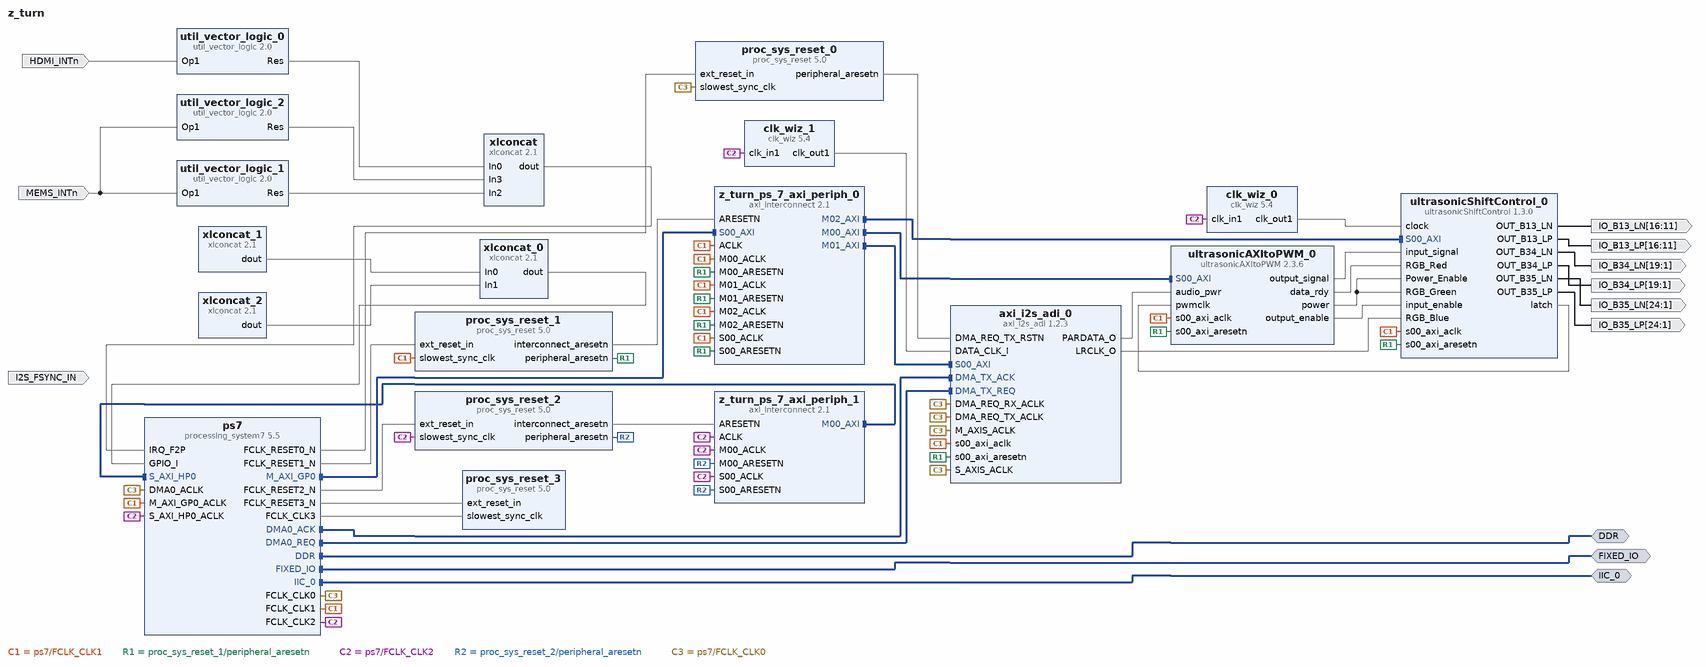
[diagram p0: block diagram of the top level]
# Vivado block design z_turn, xc7z020clg400-1, Vivado 2017.1
create_bd_design z_turn

create_bd_intf_port -mode Master -vlnv xilinx.com:interface:ddrx_rtl:1.0 DDR
create_bd_intf_port -mode Master -vlnv xilinx.com:display_processing_system7:fixedio_rtl:1.0 FIXED_IO
create_bd_intf_port -mode Master -vlnv xilinx.com:interface:iic_rtl:1.0 IIC_0
create_bd_port -dir I I2S_FSYNC_IN
create_bd_port -dir I HDMI_INTn
create_bd_port -dir I MEMS_INTn
create_bd_port -dir O -from 24 -to 1 IO_B35_LP
create_bd_port -dir O -from 24 -to 1 IO_B35_LN
create_bd_port -dir O -from 19 -to 1 IO_B34_LP
create_bd_port -dir O -from 19 -to 1 IO_B34_LN
create_bd_port -dir O -from 16 -to 11 IO_B13_LP
create_bd_port -dir O -from 16 -to 11 IO_B13_LN

create_bd_cell -type ip -vlnv xilinx.com:ip:xlconcat:2.1 xlconcat
set_property -dict {CONFIG.NUM_PORTS 16} [get_bd_cells xlconcat]
create_bd_cell -type ip -vlnv xilinx.com:ip:xlconcat:2.1 xlconcat_0
set_property -dict {CONFIG.IN0_WIDTH 32 CONFIG.IN1_WIDTH 32} [get_bd_cells xlconcat_0]
create_bd_cell -type ip -vlnv xilinx.com:ip:xlconcat:2.1 xlconcat_1
set_property -dict {CONFIG.NUM_PORTS 32} [get_bd_cells xlconcat_1]
create_bd_cell -type ip -vlnv xilinx.com:ip:xlconcat:2.1 xlconcat_2
set_property -dict {CONFIG.NUM_PORTS 29 CONFIG.IN24_WIDTH 4 CONFIG.IN28_WIDTH 1} [get_bd_cells xlconcat_2]
create_bd_cell -type ip -vlnv xilinx.com:ip:clk_wiz:5.4 clk_wiz_0
set_property -dict [list \
  CONFIG.PRIMITIVE PLL \
  CONFIG.CLKOUT1_REQUESTED_OUT_FREQ 166.5 \
  CONFIG.CLKOUT1_DRIVES BUFG \
  CONFIG.CLKOUT2_DRIVES BUFG \
  CONFIG.CLKOUT3_DRIVES BUFG \
  CONFIG.CLKOUT4_DRIVES BUFG \
  CONFIG.CLKOUT5_DRIVES BUFG \
  CONFIG.CLKOUT6_DRIVES BUFG \
  CONFIG.CLKOUT7_DRIVES BUFG \
  CONFIG.USE_LOCKED true \
  CONFIG.USE_RESET false \
  CONFIG.MMCM_DIVCLK_DIVIDE 1 \
  CONFIG.MMCM_CLKFBOUT_MULT_F 10 \
  CONFIG.MMCM_CLKIN1_PERIOD 10.000 \
  CONFIG.MMCM_CLKIN2_PERIOD 10.000 \
  CONFIG.MMCM_COMPENSATION ZHOLD \
  CONFIG.MMCM_CLKOUT0_DIVIDE_F 6 \
  CONFIG.CLKOUT1_JITTER 118.758 \
  CONFIG.CLKOUT1_PHASE_ERROR 98.575 \
] [get_bd_cells clk_wiz_0]
create_bd_cell -type ip -vlnv xilinx.com:ip:proc_sys_reset:5.0 proc_sys_reset_2
create_bd_cell -type ip -vlnv xilinx.com:ip:proc_sys_reset:5.0 proc_sys_reset_3
create_bd_cell -type ip -vlnv xilinx.com:ip:proc_sys_reset:5.0 proc_sys_reset_0
create_bd_cell -type ip -vlnv xilinx.com:ip:processing_system7:5.5 ps7
set_property -dict [list \
  CONFIG.PCW_FCLK_CLK1_BUF TRUE \
  CONFIG.PCW_FCLK_CLK2_BUF TRUE \
  CONFIG.PCW_FCLK_CLK3_BUF TRUE \
  CONFIG.PCW_I2C_PERIPHERAL_FREQMHZ 111.111115 \
  CONFIG.PCW_FPGA0_PERIPHERAL_FREQMHZ 166.667 \
  CONFIG.PCW_FPGA2_PERIPHERAL_FREQMHZ 100 \
  CONFIG.PCW_FPGA3_PERIPHERAL_FREQMHZ 200 \
  CONFIG.PCW_USE_S_AXI_HP0 1 \
  CONFIG.PCW_USE_DMA0 1 \
  CONFIG.PCW_USE_FABRIC_INTERRUPT 1 \
  CONFIG.PCW_EN_CLK1_PORT 1 \
  CONFIG.PCW_EN_CLK2_PORT 1 \
  CONFIG.PCW_EN_CLK3_PORT 1 \
  CONFIG.PCW_EN_RST1_PORT 1 \
  CONFIG.PCW_EN_RST2_PORT 1 \
  CONFIG.PCW_EN_RST3_PORT 1 \
  CONFIG.PCW_IRQ_F2P_INTR 1 \
  CONFIG.PCW_PERIPHERAL_BOARD_PRESET part0 \
  CONFIG.PCW_PRESET_BANK1_VOLTAGE {LVCMOS 1.8V} \
  CONFIG.PCW_UIPARAM_DDR_PARTNO {MT41K256M16 RE-15E} \
  CONFIG.PCW_QSPI_PERIPHERAL_ENABLE 1 \
  CONFIG.PCW_QSPI_QSPI_IO {MIO 1 .. 6} \
  CONFIG.PCW_QSPI_GRP_SINGLE_SS_ENABLE 1 \
  CONFIG.PCW_QSPI_GRP_SINGLE_SS_IO {MIO 1 .. 6} \
  CONFIG.PCW_QSPI_GRP_FBCLK_ENABLE 1 \
  CONFIG.PCW_QSPI_GRP_FBCLK_IO {MIO 8} \
  CONFIG.PCW_ENET0_PERIPHERAL_ENABLE 1 \
  CONFIG.PCW_ENET0_ENET0_IO {MIO 16 .. 27} \
  CONFIG.PCW_ENET0_GRP_MDIO_ENABLE 1 \
  CONFIG.PCW_ENET0_GRP_MDIO_IO {MIO 52 .. 53} \
  CONFIG.PCW_ENET_RESET_ENABLE 0 \
  CONFIG.PCW_SD0_PERIPHERAL_ENABLE 1 \
  CONFIG.PCW_SD0_SD0_IO {MIO 40 .. 45} \
  CONFIG.PCW_SD0_GRP_CD_ENABLE 1 \
  CONFIG.PCW_SD0_GRP_CD_IO {MIO 46} \
  CONFIG.PCW_SD0_GRP_WP_ENABLE 1 \
  CONFIG.PCW_SD0_GRP_WP_IO {MIO 47} \
  CONFIG.PCW_UART1_PERIPHERAL_ENABLE 1 \
  CONFIG.PCW_UART1_UART1_IO {MIO 48 .. 49} \
  CONFIG.PCW_CAN0_PERIPHERAL_ENABLE 1 \
  CONFIG.PCW_CAN0_CAN0_IO {MIO 14 .. 15} \
  CONFIG.PCW_USB0_PERIPHERAL_ENABLE 1 \
  CONFIG.PCW_USB0_USB0_IO {MIO 28 .. 39} \
  CONFIG.PCW_USB_RESET_ENABLE 1 \
  CONFIG.PCW_USB_RESET_SELECT {Share reset pin} \
  CONFIG.PCW_USB0_RESET_ENABLE 1 \
  CONFIG.PCW_USB0_RESET_IO {MIO 51} \
  CONFIG.PCW_I2C0_PERIPHERAL_ENABLE 1 \
  CONFIG.PCW_I2C0_I2C0_IO EMIO \
  CONFIG.PCW_I2C1_PERIPHERAL_ENABLE 1 \
  CONFIG.PCW_I2C1_I2C1_IO {MIO 12 .. 13} \
  CONFIG.PCW_I2C_RESET_ENABLE 0 \
  CONFIG.PCW_GPIO_MIO_GPIO_ENABLE 1 \
  CONFIG.PCW_GPIO_MIO_GPIO_IO MIO \
  CONFIG.PCW_GPIO_EMIO_GPIO_ENABLE 1 \
  CONFIG.PCW_GPIO_EMIO_GPIO_IO 64 \
  CONFIG.PCW_FPGA_FCLK1_ENABLE 1 \
  CONFIG.PCW_FPGA_FCLK2_ENABLE 1 \
  CONFIG.PCW_FPGA_FCLK3_ENABLE 1 \
] [get_bd_cells ps7]
# 223 more settings of ps7 are not shown: defaults, MIO pin electricals, DDR timing, and values the tool derives
create_bd_cell -type ip -vlnv xilinx.com:ip:axi_interconnect:2.1 z_turn_ps_7_axi_periph_0
set_property -dict {CONFIG.NUM_MI 3 CONFIG.S00_HAS_DATA_FIFO 0} [get_bd_cells z_turn_ps_7_axi_periph_0]
create_bd_cell -type ip -vlnv xilinx.com:ip:axi_interconnect:2.1 z_turn_ps_7_axi_periph_1
set_property -dict {CONFIG.NUM_MI 1 CONFIG.S00_HAS_DATA_FIFO 0} [get_bd_cells z_turn_ps_7_axi_periph_1]
create_bd_cell -type ip -vlnv xilinx.com:ip:proc_sys_reset:5.0 proc_sys_reset_1
create_bd_cell -type ip -vlnv xilinx.com:ip:util_vector_logic:2.0 util_vector_logic_0
set_property -dict {CONFIG.C_SIZE 1 CONFIG.C_OPERATION not} [get_bd_cells util_vector_logic_0]
create_bd_cell -type ip -vlnv xilinx.com:ip:util_vector_logic:2.0 util_vector_logic_1
set_property -dict {CONFIG.C_SIZE 1 CONFIG.C_OPERATION not} [get_bd_cells util_vector_logic_1]
create_bd_cell -type ip -vlnv xilinx.com:ip:util_vector_logic:2.0 util_vector_logic_2
set_property -dict {CONFIG.C_SIZE 1 CONFIG.C_OPERATION not} [get_bd_cells util_vector_logic_2]
create_bd_cell -type ip -vlnv xilinx.com:ip:clk_wiz:5.4 clk_wiz_1
set_property -dict [list \
  CONFIG.CLKOUT1_REQUESTED_OUT_FREQ 22.5792 \
  CONFIG.USE_RESET false \
  CONFIG.MMCM_DIVCLK_DIVIDE 9 \
  CONFIG.MMCM_CLKFBOUT_MULT_F 63.250 \
  CONFIG.MMCM_CLKOUT0_DIVIDE_F 31.125 \
  CONFIG.CLKOUT1_JITTER 629.510 \
  CONFIG.CLKOUT1_PHASE_ERROR 767.789 \
] [get_bd_cells clk_wiz_1]
create_bd_cell -type ip -vlnv digilentinc.com:user:axi_i2s_adi:1.2.3 axi_i2s_adi_0
set_property -dict {CONFIG.C_DMA_TYPE 1 CONFIG.C_HAS_RX 0} [get_bd_cells axi_i2s_adi_0]
create_bd_cell -type ip -vlnv user.org:user:ultrasonicShiftControl:1.3.0 ultrasonicShiftControl_0
create_bd_cell -type ip -vlnv user.org:user:ultrasonicAXItoPWM:2.3.6 ultrasonicAXItoPWM_0

# ---- connections ----

connect_bd_intf_net -intf_net ps_7_M_AXI_GP0 [get_bd_intf_pins ps7/M_AXI_GP0] [get_bd_intf_pins z_turn_ps_7_axi_periph_0/S00_AXI]
connect_bd_intf_net -intf_net io2axis_M00_AXI [get_bd_intf_pins z_turn_ps_7_axi_periph_1/M00_AXI] [get_bd_intf_pins ps7/S_AXI_HP0]
connect_bd_intf_net [get_bd_intf_pins z_turn_ps_7_axi_periph_0/M01_AXI] [get_bd_intf_pins axi_i2s_adi_0/S00_AXI]
connect_bd_intf_net [get_bd_intf_pins ps7/DMA0_ACK] [get_bd_intf_pins axi_i2s_adi_0/DMA_TX_ACK]
connect_bd_intf_net [get_bd_intf_pins ps7/DMA0_REQ] [get_bd_intf_pins axi_i2s_adi_0/DMA_TX_REQ]
connect_bd_intf_net [get_bd_intf_pins z_turn_ps_7_axi_periph_0/M02_AXI] [get_bd_intf_pins ultrasonicShiftControl_0/S00_AXI]
connect_bd_intf_net [get_bd_intf_pins z_turn_ps_7_axi_periph_0/M00_AXI] [get_bd_intf_pins ultrasonicAXItoPWM_0/S00_AXI]
connect_bd_intf_net -intf_net ps_7_DDR [get_bd_intf_ports DDR] [get_bd_intf_pins ps7/DDR]
connect_bd_intf_net -intf_net ps_7_FIXED_IO [get_bd_intf_ports FIXED_IO] [get_bd_intf_pins ps7/FIXED_IO]
connect_bd_intf_net [get_bd_intf_ports IIC_0] [get_bd_intf_pins ps7/IIC_0]
connect_bd_net -net xlconcat_0_dout [get_bd_pins xlconcat/dout] [get_bd_pins ps7/IRQ_F2P]
connect_bd_net -net ps_7_FCLK_CLK0 [get_bd_pins ps7/FCLK_CLK1] \
  [get_bd_pins ps7/M_AXI_GP0_ACLK] [get_bd_pins proc_sys_reset_1/slowest_sync_clk] [get_bd_pins axi_i2s_adi_0/s00_axi_aclk] \
  [get_bd_pins ultrasonicShiftControl_0/s00_axi_aclk] [get_bd_pins z_turn_ps_7_axi_periph_0/ACLK] \
  [get_bd_pins z_turn_ps_7_axi_periph_0/S00_ACLK] [get_bd_pins z_turn_ps_7_axi_periph_0/M00_ACLK] \
  [get_bd_pins z_turn_ps_7_axi_periph_0/M01_ACLK] [get_bd_pins z_turn_ps_7_axi_periph_0/M02_ACLK] \
  [get_bd_pins ultrasonicAXItoPWM_0/s00_axi_aclk]
connect_bd_net -net rst_ps_7_166M_peripheral_aresetn [get_bd_pins proc_sys_reset_1/peripheral_aresetn] \
  [get_bd_pins axi_i2s_adi_0/s00_axi_aresetn] [get_bd_pins ultrasonicShiftControl_0/s00_axi_aresetn] \
  [get_bd_pins z_turn_ps_7_axi_periph_0/S00_ARESETN] [get_bd_pins z_turn_ps_7_axi_periph_0/M00_ARESETN] \
  [get_bd_pins z_turn_ps_7_axi_periph_0/M01_ARESETN] [get_bd_pins z_turn_ps_7_axi_periph_0/M02_ARESETN] \
  [get_bd_pins ultrasonicAXItoPWM_0/s00_axi_aresetn]
connect_bd_net -net rst_ps_7_166M_interconnect_aresetn [get_bd_pins proc_sys_reset_1/interconnect_aresetn] \
  [get_bd_pins z_turn_ps_7_axi_periph_0/ARESETN]
connect_bd_net -net ps_7_FCLK_CLK2 [get_bd_pins ps7/FCLK_CLK2] \
  [get_bd_pins clk_wiz_0/clk_in1] [get_bd_pins proc_sys_reset_2/slowest_sync_clk] [get_bd_pins ps7/S_AXI_HP0_ACLK] \
  [get_bd_pins clk_wiz_1/clk_in1] [get_bd_pins z_turn_ps_7_axi_periph_1/ACLK] [get_bd_pins z_turn_ps_7_axi_periph_1/S00_ACLK] \
  [get_bd_pins z_turn_ps_7_axi_periph_1/M00_ACLK]
connect_bd_net -net ps_7_FCLK_RESET1_N [get_bd_pins ps7/FCLK_RESET1_N] [get_bd_pins proc_sys_reset_1/ext_reset_in]
connect_bd_net -net ps_7_FCLK_RESET2_N [get_bd_pins ps7/FCLK_RESET2_N] [get_bd_pins proc_sys_reset_2/ext_reset_in]
connect_bd_net -net proc_sys_reset2_interconnect_aresetn [get_bd_pins proc_sys_reset_2/interconnect_aresetn] \
  [get_bd_pins z_turn_ps_7_axi_periph_1/ARESETN]
connect_bd_net -net proc_sys_reset2_peripheral_aresetn [get_bd_pins proc_sys_reset_2/peripheral_aresetn] \
  [get_bd_pins z_turn_ps_7_axi_periph_1/S00_ARESETN] [get_bd_pins z_turn_ps_7_axi_periph_1/M00_ARESETN]
connect_bd_net -net ps_7_FCLK_RESET0_N [get_bd_pins ps7/FCLK_RESET0_N] [get_bd_pins proc_sys_reset_0/ext_reset_in]
connect_bd_net -net ps_7_FCLK_RESET3_N [get_bd_pins ps7/FCLK_RESET3_N] [get_bd_pins proc_sys_reset_3/ext_reset_in]
connect_bd_net -net ps_7_FCLK_CLK3 [get_bd_pins ps7/FCLK_CLK3] [get_bd_pins proc_sys_reset_3/slowest_sync_clk]
connect_bd_net -net ps_7_FCLK_CLK1 [get_bd_pins ps7/FCLK_CLK0] \
  [get_bd_pins proc_sys_reset_0/slowest_sync_clk] [get_bd_pins ps7/DMA0_ACLK] [get_bd_pins axi_i2s_adi_0/DMA_REQ_TX_ACLK] \
  [get_bd_pins axi_i2s_adi_0/S_AXIS_ACLK] [get_bd_pins axi_i2s_adi_0/M_AXIS_ACLK] [get_bd_pins axi_i2s_adi_0/DMA_REQ_RX_ACLK]
connect_bd_net [get_bd_pins util_vector_logic_0/Res] [get_bd_pins xlconcat/In0]
connect_bd_net [get_bd_ports HDMI_INTn] [get_bd_pins util_vector_logic_0/Op1]
connect_bd_net [get_bd_pins util_vector_logic_1/Res] [get_bd_pins xlconcat/In2]
connect_bd_net [get_bd_ports MEMS_INTn] [get_bd_pins util_vector_logic_1/Op1] [get_bd_pins util_vector_logic_2/Op1]
connect_bd_net [get_bd_pins util_vector_logic_2/Res] [get_bd_pins xlconcat/In3]
connect_bd_net [get_bd_pins xlconcat_1/dout] [get_bd_pins xlconcat_0/In0]
connect_bd_net [get_bd_pins xlconcat_2/dout] [get_bd_pins xlconcat_0/In1]
connect_bd_net [get_bd_pins xlconcat_0/dout] [get_bd_pins ps7/GPIO_I]
connect_bd_net [get_bd_pins clk_wiz_1/clk_out1] [get_bd_pins axi_i2s_adi_0/DATA_CLK_I]
connect_bd_net [get_bd_pins proc_sys_reset_0/peripheral_aresetn] [get_bd_pins axi_i2s_adi_0/DMA_REQ_TX_RSTN]
connect_bd_net [get_bd_pins clk_wiz_0/clk_out1] [get_bd_pins ultrasonicShiftControl_0/clock]
connect_bd_net [get_bd_pins ultrasonicShiftControl_0/OUT_B35_LP] [get_bd_ports IO_B35_LP]
connect_bd_net [get_bd_pins ultrasonicShiftControl_0/OUT_B35_LN] [get_bd_ports IO_B35_LN]
connect_bd_net [get_bd_pins ultrasonicAXItoPWM_0/output_signal] [get_bd_pins ultrasonicShiftControl_0/input_signal]
connect_bd_net [get_bd_pins ultrasonicAXItoPWM_0/data_rdy] [get_bd_pins ultrasonicShiftControl_0/RGB_Red]
connect_bd_net [get_bd_pins ultrasonicAXItoPWM_0/power] \
  [get_bd_pins ultrasonicShiftControl_0/RGB_Green] [get_bd_pins ultrasonicShiftControl_0/Power_Enable]
connect_bd_net [get_bd_pins ultrasonicShiftControl_0/latch] [get_bd_pins ultrasonicAXItoPWM_0/pwmclk]
connect_bd_net [get_bd_pins ultrasonicShiftControl_0/OUT_B34_LP] [get_bd_ports IO_B34_LP]
connect_bd_net [get_bd_pins ultrasonicShiftControl_0/OUT_B34_LN] [get_bd_ports IO_B34_LN]
connect_bd_net [get_bd_pins ultrasonicShiftControl_0/OUT_B13_LP] [get_bd_ports IO_B13_LP]
connect_bd_net [get_bd_pins ultrasonicShiftControl_0/OUT_B13_LN] [get_bd_ports IO_B13_LN]
connect_bd_net [get_bd_pins ultrasonicAXItoPWM_0/output_enable] [get_bd_pins ultrasonicShiftControl_0/input_enable]
connect_bd_net [get_bd_pins axi_i2s_adi_0/PARDATA_O] [get_bd_pins ultrasonicAXItoPWM_0/audio_pwr]
connect_bd_net [get_bd_pins axi_i2s_adi_0/LRCLK_O] [get_bd_pins ultrasonicShiftControl_0/RGB_Blue]

# ---- address map ----
assign_bd_address -offset 0x43C00000 -range 64K -target_address_space [get_bd_addr_spaces ps7/Data] [get_bd_addr_segs ultrasonicAXItoPWM_0/S00_AXI/S00_AXI_reg]
assign_bd_address -offset 0x43C10000 -range 64K -target_address_space [get_bd_addr_spaces ps7/Data] [get_bd_addr_segs ultrasonicShiftControl_0/S00_AXI/S00_AXI_reg]
assign_bd_address -offset 0x43C20000 -range 64K -target_address_space [get_bd_addr_spaces ps7/Data] [get_bd_addr_segs axi_i2s_adi_0/S00_AXI/S00_AXI_reg]

validate_bd_design
save_bd_design
